# Altium schematic sheet RelayExtension.SchDoc: RelayExtension
size A4; Date: JUN 2020; ApprovedBy: Hören; CheckedBy: Mörz; Author: Rudziński; CompanyName: Semi-ATE; DrawnBy: Rudziński; Engineer: Hören; Organization: Semi-ATE; DocumentNumber: 6; Revision: V1.0; SheetNumber: 6; SheetTotal: 20
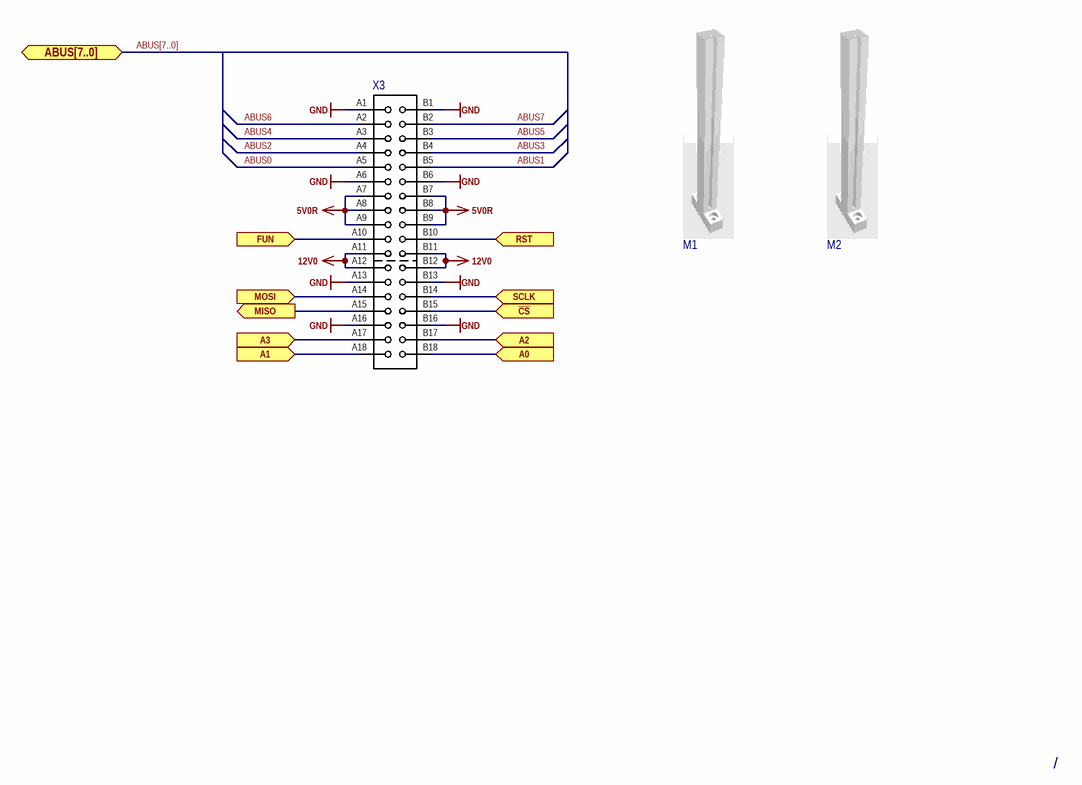
[diagram p0: RelayExtension.SchDoc]

## Parts
M1  M  [Support Post]  (value not drawn)
M2  M  [Support Post]  (value not drawn)
X3  X  [PCIE-036-02-F-D-TH]  (value not drawn)

## Ports
A0 (in), A1 (in), A2 (in), A3 (in), ABUS[7..0] (bidir), FUN (in), MISO (out), MOSI (in), RST (in), SCLK (in), ~{CS} (in)

## Nets
5V0R: X3.A7 X3.A8 X3.A9 X3.B7 X3.B8 X3.B9
12V0: X3.A11 X3.A12 X3.B11 X3.B12
GND: X3.A1 X3.A6 X3.A13 X3.A16 X3.B1 X3.B6 X3.B13 X3.B16
~{CS}: X3.B15 ; port ~{CS}
A0: X3.B18 ; port A0
A1: X3.A18 ; port A1
A2: X3.B17 ; port A2
A3: X3.A17 ; port A3
ABUS0: X3.A5
ABUS1: X3.B5
ABUS2: X3.A4
ABUS3: X3.B4
ABUS4: X3.A3
ABUS5: X3.B3
ABUS6: X3.A2
ABUS7: X3.B2
FUN: X3.A10 ; port FUN
MISO: X3.A15 ; port MISO
MOSI: X3.A14 ; port MOSI
RST: X3.B10 ; port RST
SCLK: X3.B14 ; port SCLK

## Buses and harness runs
bus ABUS[7..0] = port ABUS[7..0]

## Notes on the sheet
- /
- designed by
- reviewed by
- last drawn by
- Project:
- Schematic:
- last printed
- DIN-A4 L
- sheets
- of
- File:

## Library data of the parts
M1 M2 = Support Post: 03. Unit Price: 2.0; 13. Created Date/Name: ??? / Hören; System: Connector; 01. Distributor: Likom; 02. Distributor Part Number: N/A; 04. Manufacturer: N/A; 07. Manufacturer  Part Number: N/A; ComponentLink1Description: Info; ComponentLink2Description: DataSheet
X3 = PCIE-036-02-F-D-TH: CONN PCI EXP FMALE 36POS 0.039; 04. Manufacturer: Samtec Inc.; 03. Unit Price: 1.76; 13. Created Date/Name: ??? / Hören; System: Connector; 01. Distributor: DigiKey; 02. Distributor Part Number: SAM10625-ND; 07. Manufacturer  Part Number: PCIE-036-02-F-D-TH; ComponentLink1Description: Info; ComponentLink1URL: https://www.digikey.de/products/en?keywords=PCIE-036-02-F-D-TH; ComponentLink2Description: DataSheet; ComponentLink2URL: http://suddendocs.samtec.com/catalog_english/pcie.pdf